# EAGLE design battery_monitor_6803-2 (EAGLE 6.3)
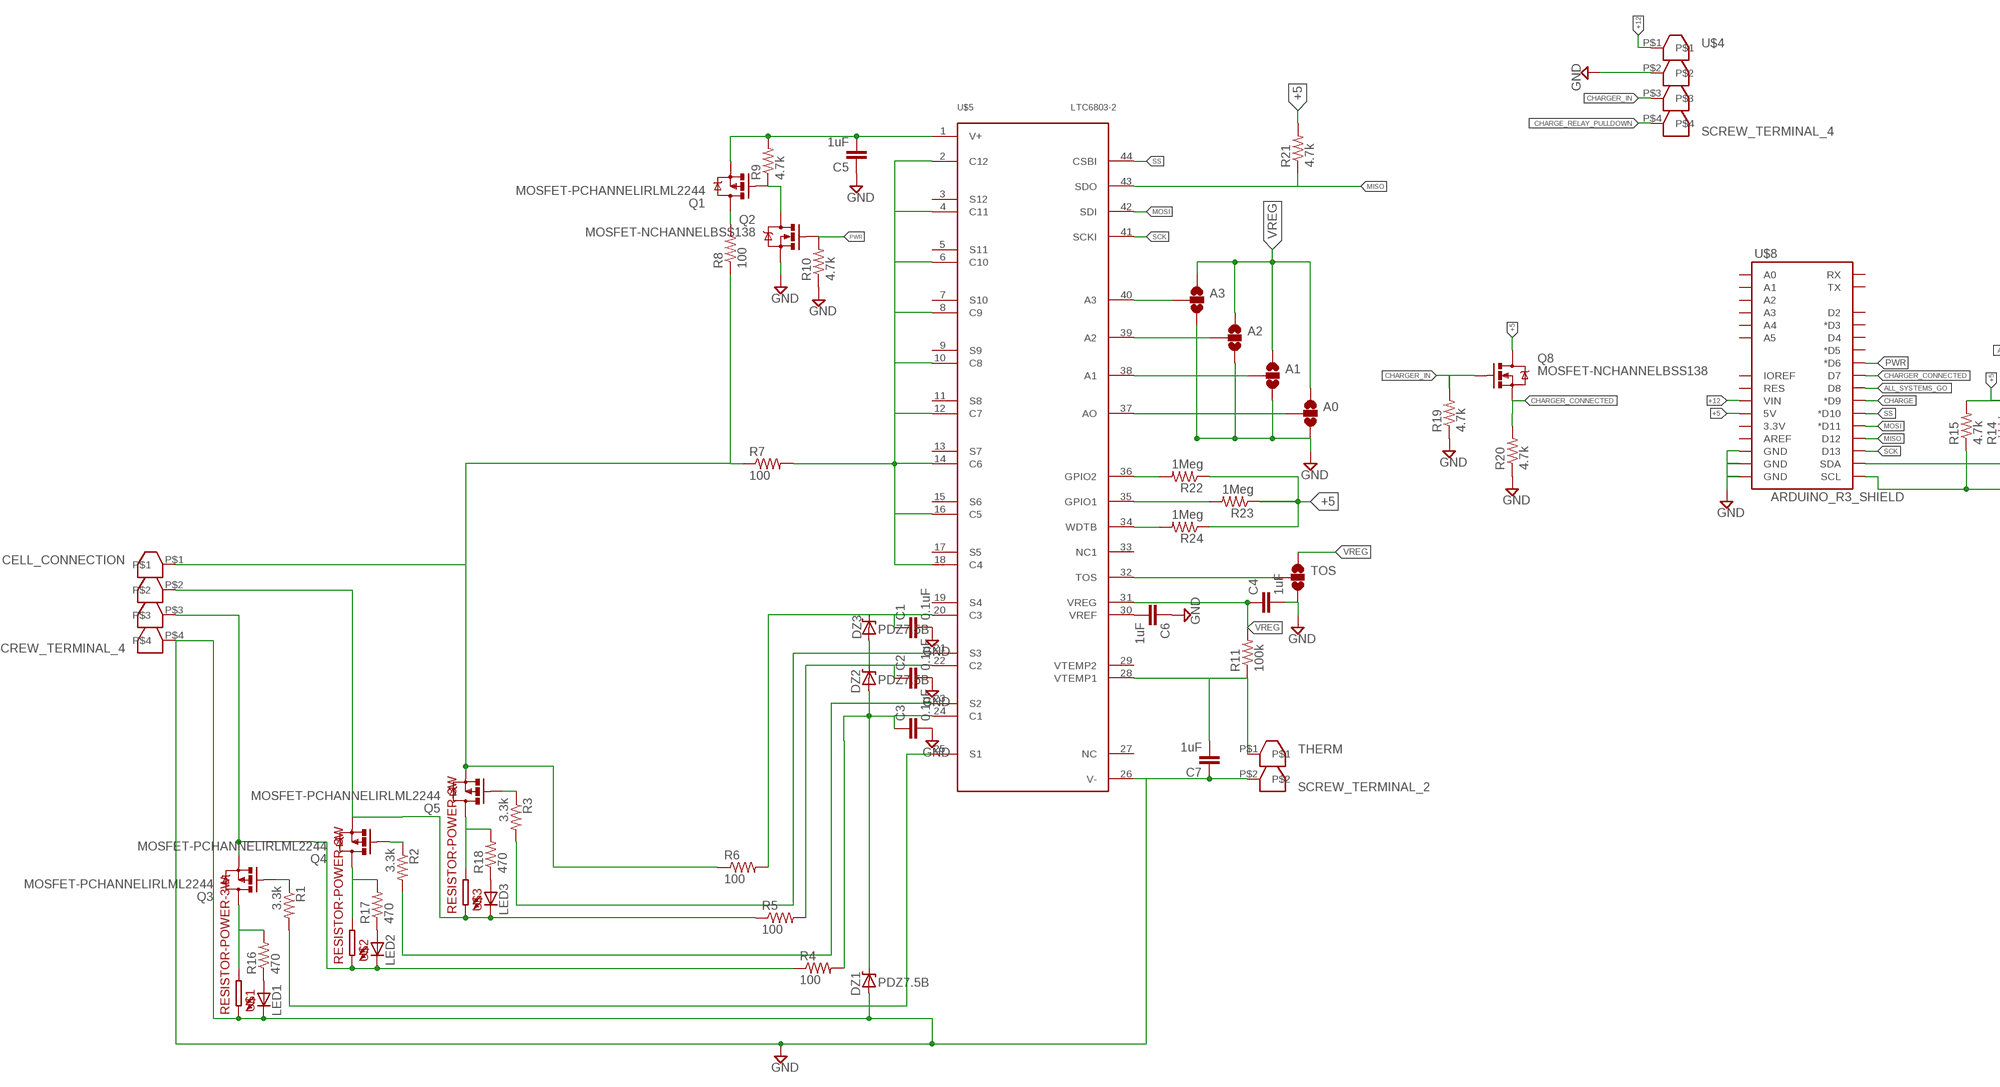
[diagram p0: schematic, sheet 1, part 1 of 2]
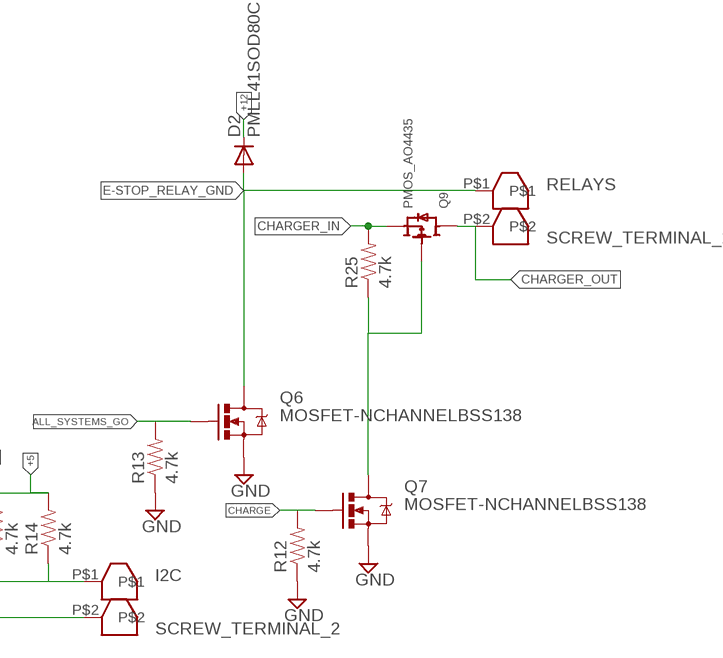
[diagram p1: schematic, sheet 1, part 2 of 2]

## Parts
A0  SOLDERJUMPER_2WAYS  [SJ_3]
A1  SOLDERJUMPER_2WAYS  [SJ_3]
A2  SOLDERJUMPER_2WAYS  [SJ_3]
A3  SOLDERJUMPER_2WAYS  [SJ_3]
C1  0.1uF  0.1UF-100V-10%(0603)  [0603-CAP]
C2  0.1uF  0.1UF-100V-10%(0603)  [0603-CAP]
C3  0.1uF  0.1UF-100V-10%(0603)  [0603-CAP]
C4  1uF  0.1UF-100V-10%(0603)  [0603-CAP]
C5  1uF  0.1UF-100V-10%(0603)  [0603-CAP]
C6  1uF  0.1UF-100V-10%(0603)  [0603-CAP]
C7  1uF  0.1UF-100V-10%(0603)  [0603-CAP]
CELL_CONNECTION  SCREW_TERMINAL_4  [SCREW_TERMINAL_4]
D2  PMLL41SOD80C  [SOD80C]
DZ1  PDZ7.5B  DIODE-ZENER-BZT52  [SOD-323]
DZ2  PDZ7.5B  DIODE-ZENER-BZT52  [SOD-323]
DZ3  PDZ7.5B  DIODE-ZENER-BZT52  [SOD-323]
I2C  SCREW_TERMINAL_2  [SCREW_TERMINAL_2]
LED1  LED0603  [LED-0603]
LED2  LED0603  [LED-0603]
LED3  LED0603  [LED-0603]
Q1  MOSFET-PCHANNELIRLML2244  [SOT23-3]
Q2  MOSFET-NCHANNELBSS138  [SOT23]
Q3  MOSFET-PCHANNELIRLML2244  [SOT23-3]
Q4  MOSFET-PCHANNELIRLML2244  [SOT23-3]
Q5  MOSFET-PCHANNELIRLML2244  [SOT23-3]
Q6  MOSFET-NCHANNELBSS138  [SOT23]
Q7  MOSFET-NCHANNELBSS138  [SOT23]
Q8  MOSFET-NCHANNELBSS138  [SOT23]
Q9  PMOS_AO4435  [SOIC8]
R1  3.3k  3.3KOHM1/10W1%(0603)  [0603-RES]
R2  3.3k  3.3KOHM1/10W1%(0603)  [0603-RES]
R3  3.3k  3.3KOHM1/10W1%(0603)  [0603-RES]
R4  100  3.3KOHM1/10W1%(0603)  [0603-RES]
R5  100  3.3KOHM1/10W1%(0603)  [0603-RES]
R6  100  3.3KOHM1/10W1%(0603)  [0603-RES]
R7  100  3.3KOHM1/10W1%(0603)  [0603-RES]
R8  100  3.3KOHM1/10W1%(0603)  [0603-RES]
R9  4.7k  3.3KOHM1/10W1%(0603)  [0603-RES]
R10  4.7k  3.3KOHM1/10W1%(0603)  [0603-RES]
R11  100k  3.3KOHM1/10W1%(0603)  [0603-RES]
R12  4.7k  3.3KOHM1/10W1%(0603)  [0603-RES]
R13  4.7k  3.3KOHM1/10W1%(0603)  [0603-RES]
R14  4.7k  3.3KOHM1/10W1%(0603)  [0603-RES]
R15  4.7k  3.3KOHM1/10W1%(0603)  [0603-RES]
R16  470  3.3KOHM1/10W1%(0603)  [0603-RES]
R17  470  3.3KOHM1/10W1%(0603)  [0603-RES]
R18  470  3.3KOHM1/10W1%(0603)  [0603-RES]
R19  4.7k  3.3KOHM1/10W1%(0603)  [0603-RES]
R20  4.7k  3.3KOHM1/10W1%(0603)  [0603-RES]
R21  4.7k  3.3KOHM1/10W1%(0603)  [0603-RES]
R22  1Meg  3.3KOHM1/10W1%(0603)  [0603-RES]
R23  1Meg  3.3KOHM1/10W1%(0603)  [0603-RES]
R24  1Meg  3.3KOHM1/10W1%(0603)  [0603-RES]
R25  4.7k  3.3KOHM1/10W1%(0603)  [0603-RES]
RELAYS  SCREW_TERMINAL_2  [SCREW_TERMINAL_2]
THERM  SCREW_TERMINAL_2  [SCREW_TERMINAL_2]
TOS  SOLDERJUMPER_2WAYS  [SJ_3]
U$1  RESISTOR-POWER-3W  [RESISTOR-3W]
U$2  RESISTOR-POWER-3W  [RESISTOR-3W]
U$3  RESISTOR-POWER-3W  [RESISTOR-3W]
U$4  SCREW_TERMINAL_4  [SCREW_TERMINAL_4]
U$5  LTC6803-2  [FSOP-44]
U$8  ARDUINO_R3_SHIELD  [UNO_R3_SHIELD]

## Nets
+5: Q8.3(D) R14.2 R15.2 R21.2 R22.1 R23.1 R24.1 U$8.5V
+12: D2.C U$4.P$1 U$8.VIN
ALL_SYSTEMS_GO: Q6.1(G) R13.2 U$8.D8
CHARGE: Q7.1(G) R12.2 U$8.D9(*D9)
CHARGE_RELAY_PULLDOWN: U$4.P$4
CHARGER_CONNECTED: Q8.2(S) R20.2 U$8.D7
CHARGER_IN: Q8.1(G) Q9.1(SOURCE) Q9.2(SOURCE) Q9.3(SOURCE) R19.2 R25.2 U$4.P$3
CHARGER_OUT: Q9.5(DRAIN) Q9.6(DRAIN) Q9.7(DRAIN) Q9.8(DRAIN) RELAYS.P$2
E-STOP_RELAY_GND: D2.A Q6.3(D) RELAYS.P$1
GND: A0.3 A1.3 A2.3 A3.3 C1.2 C2.2 C3.2 C4.2 C5.1 C6.1 C7.1 CELL_CONNECTION.P$4 DZ1.2(A) LED1.C Q2.2(S) Q6.2(S) Q7.2(S) R10.1 R12.1 R13.1 R19.1 R20.1 THERM.P$2 TOS.3 U$1.P$2 U$4.P$2 U$5.26(V-) U$8.GND@0(GND) U$8.GND@1(GND) U$8.GND@2(GND)
MISO: R21.1 U$5.43(SDO) U$8.D12
MOSI: U$5.42(SDI) U$8.D11(*D11)
N$1: Q7.3(D) Q9.4(GATE) R25.1
N$2: CELL_CONNECTION.P$3 LED2.C Q3.2(S) R4.1 U$2.P$2
N$3: CELL_CONNECTION.P$2 LED3.C Q4.2(S) R5.1 U$3.P$2
N$4: CELL_CONNECTION.P$1 Q5.2(S) R6.1 R7.1 R8.1
N$5: Q3.3(D) R16.2 U$1.P$1
N$6: R2.2 U$5.23(S2)
N$7: Q3.1(G) R1.1
N$8: R1.2 U$5.25(S1)
N$9: R3.2 U$5.21(S3)
N$10: Q4.3(D) R17.2 U$2.P$1
N$11: Q4.1(G) R2.1
N$12: Q5.3(D) R18.2 U$3.P$1
N$13: LED1.A R16.1
N$14: C1.1 DZ3.1(C) R6.2 U$5.20(C3)
N$15: C3.1 DZ1.1(C) DZ2.2(A) R4.2 U$5.24(C1)
N$16: C2.1 DZ2.1(C) DZ3.2(A) R5.2 U$5.22(C2)
N$17: R7.2 U$5.2(C12) U$5.4(C11) U$5.6(C10) U$5.8(C9) U$5.10(C8) U$5.12(C7) U$5.14(C6) U$5.16(C5) U$5.18(C4)
N$18: Q1.3(D) R8.2
N$19: C5.2 Q1.2(S) R9.2 U$5.1(V+)
N$20: Q1.1(G) Q2.3(D) R9.1
N$21: C7.2 R11.1 THERM.P$1 U$5.28(VTEMP1)
N$22: LED2.A R17.1
N$23: LED3.A R18.1
N$24: R22.2 U$5.36(GPIO2)
N$25: R23.2 U$5.35(GPIO1)
N$27: R24.2 U$5.34(WDTB)
N$28: A3.2 U$5.40(A3)
N$29: Q5.1(G) R3.1
N$30: A2.2 U$5.39(A2)
N$31: A1.2 U$5.38(A1)
N$32: A0.2 U$5.37(AO)
N$33: TOS.2 U$5.32(TOS)
N$34: C6.2 U$5.30(VREF)
PWR: Q2.1(G) R10.2 U$8.D6(*D6)
SCK: U$5.41(SCKI) U$8.D13
SCL: I2C.P$2 R15.1 U$8.SCL
SDA: I2C.P$1 R14.1 U$8.SDA
SS: U$5.44(CSBI) U$8.D10(*D10)
VREG: A0.1 A1.1 A2.1 A3.1 C4.1 R11.2 TOS.1 U$5.31(VREG)
Unconnected: U$5.3(S12) U$5.5(S11) U$5.7(S10) U$5.9(S9) U$5.11(S8) U$5.13(S7) U$5.15(S6) U$5.17(S5) U$5.19(S4) U$5.27(NC) U$5.29(VTEMP2) U$5.33(NC1) U$8.3.3V U$8.A0 U$8.A1 U$8.A2 U$8.A3 U$8.A4 U$8.A5 U$8.AREF U$8.D2 U$8.D3(*D3) U$8.D4 U$8.D5(*D5) U$8.IOREF U$8.RES U$8.RX U$8.TX

## Library data of the parts
A0 A1-A3 TOS = SparkFun:SOLDERJUMPER_2WAY: Solder Jumper 2 way solder jumper
C1-C3 = SparkFun-Capacitors:0.1UF-100V-10%(0603): CAP-08390; PROD_ID: CAP-08390
C4-C7 = SparkFun-Capacitors:0.1UF-100V-10%(0603): CAP-08390; PROD_ID: CAP-08390; VALUE: 0.1uF
CELL_CONNECTION U$4 = isaac1:SCREW_TERMINAL_4
D2 = diode:PMLL41*: High-speed diodes Source: http://www.semiconductors.philips.com/acrobat_download/datasheets/PMLL4150_2.pdf
DZ1-DZ3 = SparkFun-DiscreteSemi:DIODE-ZENER: Zener Diode Production Part - 8199 3.4V Zener Voltage
I2C RELAYS THERM = isaac1:SCREW_TERMINAL_2
LED1-LED3 = SparkFun-LED:LED: LEDs Standard schematic elements and footprints for 5mm, 3mm, 1206, and 0603 sized LEDs. 5mm - Spark Fun Electronics SKU : COM-00529 (and others)
Q1 Q3-Q5 = SparkFun-DiscreteSemi:MOSFET-PCHANNEL: Generic PMOSFET; PROD_ID: TRANS-11153
Q2 Q6-Q8 = SparkFun-DiscreteSemi:MOSFET-NCHANNEL: Common NMOSFET Parts MFG P/N Store ID Prod ID FDD8780 TRANS-09984 SI7820DN TRANS-11055 FDS6630A IC-08089 2N7002PW TRANS-11151 FQP30N06L COM-10213 TRANS-10060 BSS123LT1G TRANS-08345 BSS138 TRANS-00830 BS170 2N7000; PROD_ID: TRANS-00830
Q9 = isaac1:PMOS_AO4435
R1-R25 = SparkFun-Resistors:3.3KOHM1/10W1%(0603): RES-07851; PROD_ID: RES-07851
U$1-U$3 = isaac1:RESISTOR-POWER-3W: PR03 series .205" dia x .657" L
U$5 = isaac1:LTC6803-2
U$8 = SparkFun-Boards:ARDUINO_R3_SHIELD: Shield form compatible with the Arduino Uno R3.

## Board
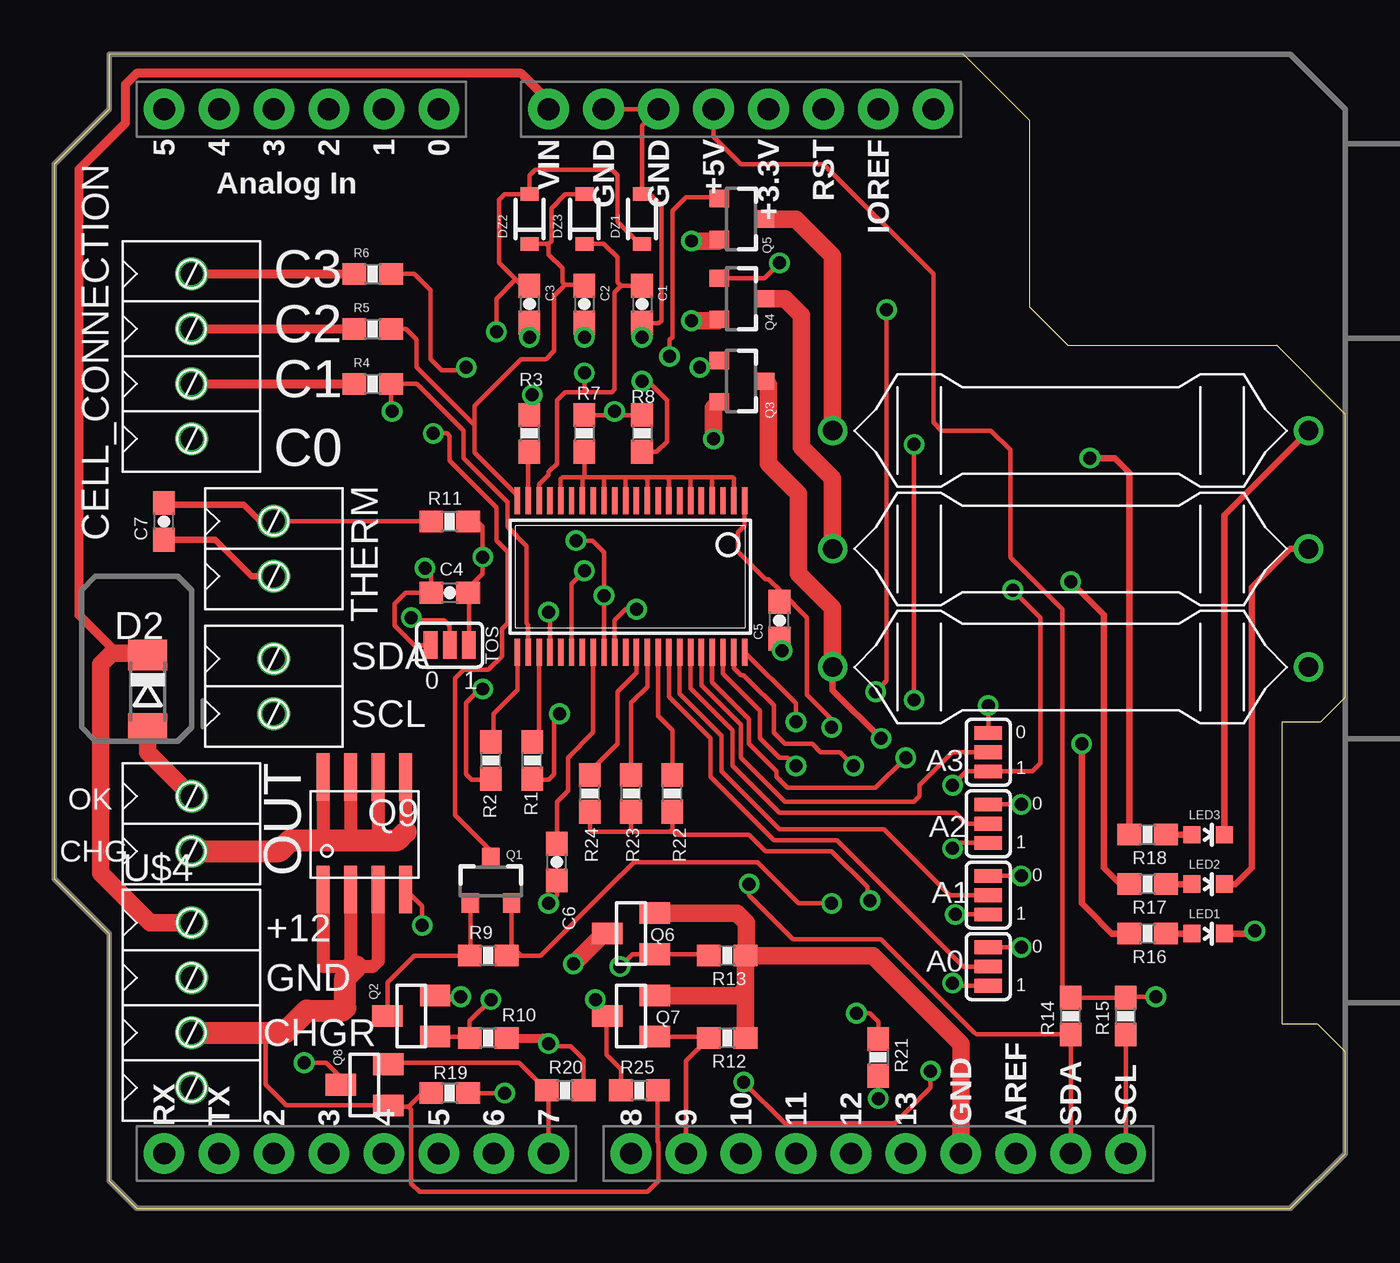
[diagram p2: board, top side]
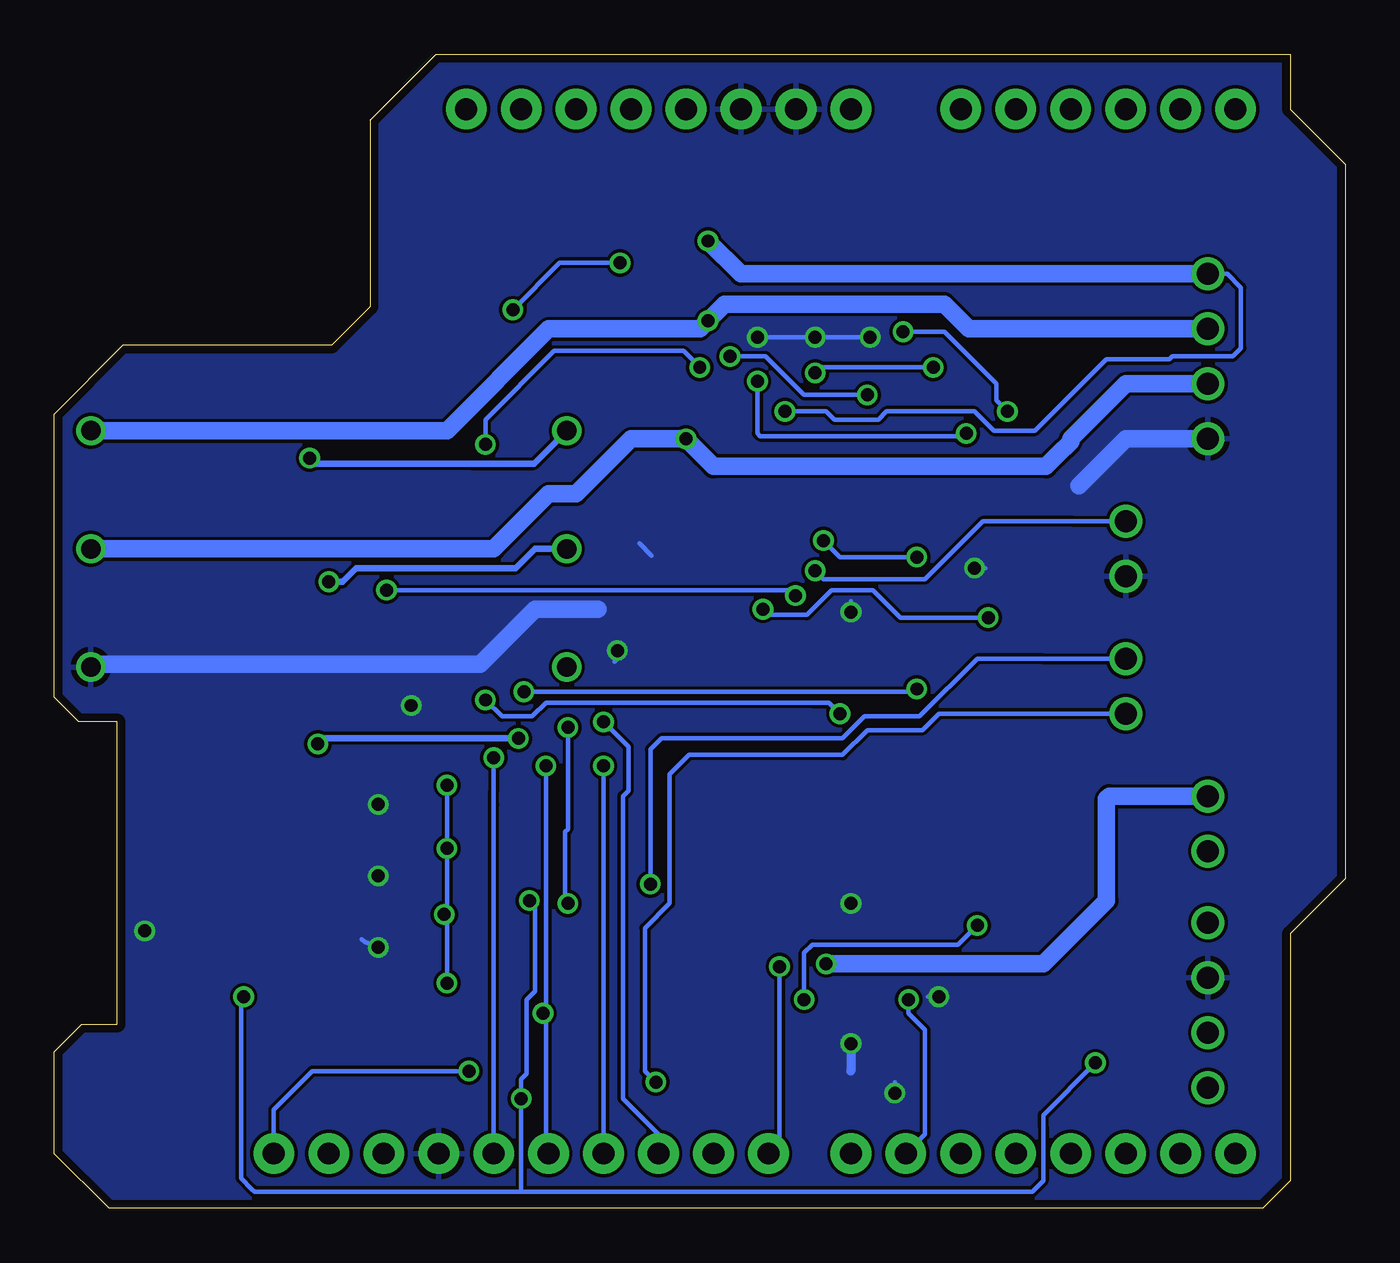
[diagram p3: board, bottom side, seen from below]

Size 59.69 x 53.34 mm. Coordinates in mm from the lower left corner, seen from the top.
Outline: 0,15.24 2.54,12.7 2.54,1.27 3.81,0 57.15,0 59.69,2.54 59.69,7.24 58.42,8.51 56.77,8.51 56.77,22.48 58.55,22.48 59.69,23.62 59.69,36.7 56.52,39.88 46.86,39.88 45.09,41.66 45.09,50.29 42.04,53.34 2.54,53.34 2.54,50.8 0,48.26 0,15.24
Copper layers (1*16): Top 0.0356mm / dielectric 1.5011mm / Bottom 0.0356mm
Design rules "LaenPCBOrder *": minimum track width 6mil, minimum drill 13mil, track to track 6mil, track to pad 6mil, pad to pad 6mil, via to via 6mil, smd to smd 6mil, copper to edge 15mil, drill to drill 6mil, minimum pad ring 7mil, minimum via ring 7mil, stop-mask expansion 4mil, vias tented up to drill 24mil, thermal gap 10mil

### Footprints (pad centres in the part's own frame; a part is rotated, then mirrored left to right if it is on the bottom)
SJ_3 = smd 0.635 x 1.27: 1 -0.889,0; 2 0,0; 3 0.889,0
0603-CAP = smd 1.1 x 1: 1 -0.85,0; 2 0.85,0
SCREW_TERMINAL_4 = drill 1.016 pad 1.422: P$1 0,3.81; P$2 0,1.27; P$3 0,-1.27; P$4 0,-3.81
SOD80C = smd 1.4 x 1.8: A 1.7,0; C -1.7,0
SOD-323 = smd 0.63 x 0.83: 1 -1.15,0; 2 1.15,0
SCREW_TERMINAL_2 = drill 1.016 pad 1.422: P$1 0,1.27; P$2 0,-1.27
LED-0603 = smd 0.8 x 0.8: A 0,-0.75; C 0,0.75
SOT23-3 = smd 0.8 x 0.9: 1 -0.95,-1; 2 0.95,-1; 3 0,1.1
SOT23 = smd 1 x 1.4: 1 -0.95,-1.1; 2 0.95,-1.1; 3 0,1.1
SOIC8 = smd 0.6 x 2.2: 1 -1.905,-2.54; 2 -0.635,-2.54; 3 0.635,-2.54; 4 1.905,-2.54; 5 1.905,2.66; 6 0.635,2.66; 7 -0.635,2.66; 8 -1.905,2.66
0603-RES = smd 1.1 x 1: 1 -0.85,0; 2 0.85,0
RESISTOR-3W = drill 0.9: P$1 0,11; P$2 0,-11
FSOP-44 = smd 0.25 x 1.25: 1 -5.25,-3.5; 2 -4.75,-3.5; 3 -4.25,-3.5; 4 -3.75,-3.5; 5 -3.25,-3.5; 6 -2.75,-3.5; 7 -2.25,-3.5; 8 -1.75,-3.5; 9 -1.25,-3.5; 10 -0.75,-3.5; 11 -0.25,-3.5; 12 0.25,-3.5; 13 0.75,-3.5; 14 1.25,-3.5; 15 1.75,-3.5; 16 2.25,-3.5; 17 2.75,-3.5; 18 3.25,-3.5; 19 3.75,-3.5; 20 4.25,-3.5; 21 4.75,-3.5; 22 5.25,-3.5; 23 5.25,3.5; 24 4.75,3.5; 25 4.25,3.5; 26 3.75,3.5; 27 3.25,3.5; 28 2.75,3.5; 29 2.25,3.5; 30 1.75,3.5; 31 1.25,3.5; 32 0.75,3.5; 33 0.25,3.5; 34 -0.25,3.5; 35 -0.75,3.5; 36 -1.25,3.5; 37 -1.75,3.5; 38 -2.25,3.5; 39 -2.75,3.5; 40 -3.25,3.5; 41 -3.75,3.5; 42 -4.25,3.5; 43 -4.75,3.5; 44 -5.25,3.5
UNO_R3_SHIELD = drill 1.016 pad 1.88: 3.3V 50.8,26.67; 5V 50.8,29.21; A0 50.8,41.91; A1 50.8,44.45; A2 50.8,46.99; A3 50.8,49.53; A4 50.8,52.07; A5 50.8,54.61; AREF 2.54,15.24; D2 2.54,49.53; D3 2.54,46.99; D4 2.54,44.45; D5 2.54,41.91; D6 2.54,39.37; D7 2.54,36.83; D8 2.54,33.02; D9 2.54,30.48; D10 2.54,27.94; D11 2.54,25.4; D12 2.54,22.86; D13 2.54,20.32; GND@0 50.8,31.75; GND@1 50.8,34.29; GND@2 2.54,17.78; IOREF 50.8,21.59; NC 50.8,19.05; RES 50.8,24.13; RX 2.54,54.61; SCL 2.54,10.16; SDA 2.54,12.7; TX 2.54,52.07; VIN 50.8,36.83

### Placement (x,y rotation side)
A0  43.18,11.18 90 top
A1  43.18,14.48 90 top
A2  43.18,17.78 90 top
A3  43.18,21.08 90 top
C1  27.18,41.78 270 top
C2  24.51,41.78 270 top
C3  21.97,41.78 270 top
C4  18.29,28.45 180 top
C5  33.53,27.18 90 top
C6  23.24,16 90 top
C7  5.08,31.75 90 top
CELL_CONNECTION  6.35,39.37 0 top
D2  4.32,23.88 270 top
DZ1  27.18,45.72 90 top
DZ2  21.97,45.72 90 top
DZ3  24.51,45.72 90 top
I2C  10.16,24.13 0 top
LED1  53.34,12.7 270 top
LED2  53.34,14.99 270 top
LED3  53.34,17.27 270 top
Q1  20.19,15.11 0 top
Q2  16.51,8.89 90 top
Q3  31.75,38.23 270 top
Q4  31.75,42.04 270 top
Q5  31.75,45.72 270 top
Q6  26.67,12.7 90 top
Q7  26.67,8.89 90 top
Q8  14.35,5.71 90 top
Q9  14.35,17.27 0 top
R1  22.1,20.7 90 top
R2  20.19,20.7 90 top
R3  21.97,35.81 270 top
R4  14.73,38.1 0 top
R5  14.73,40.64 0 top
R6  14.73,43.18 0 top
R7  24.51,35.81 270 top
R8  27.18,35.81 270 top
R9  20.07,11.68 0 top
R10  20.07,7.87 180 top
R11  18.29,31.75 0 top
R12  31.11,7.87 180 top
R13  31.11,11.68 180 top
R14  46.99,8.89 90 top
R15  49.53,8.89 90 top
R16  50.55,12.7 180 top
R17  50.55,14.99 180 top
R18  50.55,17.27 180 top
R19  18.29,5.33 180 top
R20  23.62,5.46 180 top
R21  38.1,6.99 270 top
R22  28.57,19.18 90 top
R23  26.67,19.18 90 top
R24  24.77,19.18 90 top
R25  27.05,5.46 0 top
RELAYS  6.35,17.78 0 top
THERM  10.16,30.48 0 top
TOS  18.29,26.04 180 top
U$1  46.99,25.02 90 top
U$2  46.99,30.48 90 top
U$3  46.99,35.94 90 top
U$4  6.35,9.4 0 top
U$5  26.67,29.21 180 top
U$8  59.69,0 90 top

### Tracks (layer width: path | path; a pad name or v marks a point on that pad's centre or on a via)
+5  (via drill 0.6)
  Top 0.203: U$8.5V 30.48,49.53 31.75,48.26 35.56,48.26 40.64,43.18 40.64,36.32 41.02,35.94 43.31,35.94 44.2,35.05 44.2,30.1 46.61,27.69 46.61,17.91 46.61,10.12 R14.2 R15.2 49.57,9.78 v50.93,9.78 | Q8.3 13.25,6.05 12.57,6.73 v11.56,6.73 | R21.2 v38.1,5.08 | R24.1 24.77,17.53 24.89,17.4 26.54,17.4 26.67,17.53 | 26.67,17.53 R23.1 | R22.1 28.57,17.53 28.45,17.4 | 28.45,17.4 26.8,17.4 26.67,17.53 | 28.45,17.4 28.7,17.4 28.83,17.27 32.13,17.27 32.89,16.51 35.94,16.51 37.59,14.86 37.59,14.35 v37.72,14.22
  Bottom 0.203: v50.93,9.78 51.05,9.65 51.05,1.4 50.55,0.89 50.42,0.76 38.1,0.76 | 38.1,0.76 14.48,0.76 13.97,1.27 13.97,3.81 13.97,4.32 v11.56,6.73 | 38.1,0.76 v38.1,5.08 38.1,5.97 37.85,6.22 37.85,9.65 37.47,10.03 37.47,13.97 v37.72,14.22
+12
  Top 0.406: U$8.VIN 22.86,51.18 21.59,52.45 3.81,52.45 3.3,51.94 3.3,50.16 3.05,49.91 1.14,48.01 1.14,27.43 2.92,25.65
  Top 0.813: U$4.P$1 4.45,13.21 2.16,15.49 2.16,25.15 2.67,25.65 2.92,25.65 4.24,25.65 D2.C
ALL_SYSTEMS_GO  (via drill 0.6)
  Top 0.203: R13.2 30.2,11.75 Q6.1 26.74,11.75 v26.16,11.18
  Top 0.813: 30.2,11.75 R13.2
  Bottom 0.203: v26.16,11.18 26.16,3.05 U$8.D8
CHARGE
  Top 0.203: Q7.1 30.2,7.94 R12.2 29.21,6.82 U$8.D9
CHARGER_CONNECTED
  Top 0.203: U$8.D7 22.86,5.37 R20.2 21.5,6.73 15.52,6.73 Q8.2
CHARGER_IN
  Top 0.203: R19.2 17.02,5.33 16.38,4.7 | 16.38,4.7 15.52,4.7 Q8.1 10.73,4.76 9.78,5.71 9.78,7.87 9.53,8.13 U$4.P$3 | R25.2 27.9,3.09 27.94,3.05 27.94,1.27 27.43,0.76 16.89,0.76 16.51,1.14 16.51,4.57 16.38,4.7
  Top 0.61: Q9.1 12.45,11.18 13.46,11.18 13.72,11.43 | Q9.2 13.72,11.43 | Q9.3 14.99,11.43 14.73,11.18 13.97,11.18 13.72,11.43
  Top 1.016: U$4.P$3 10.67,8.13 11.68,9.14 13.34,9.14 13.46,9.27 13.46,10.67 13.97,11.18
CHARGER_OUT
  Top 0.61: Q9.8 12.45,17.02 | 12.45,17.02 12.32,16.89 | Q9.7 13.72,17.14 | 13.72,17.14 13.59,17.02 12.45,17.02 | Q9.6 14.99,17.27 | 14.99,17.27 14.73,17.02 13.84,17.02 13.72,17.14 | Q9.5 16.26,17.4 16.26,17.27 15.88,16.89 15.37,16.89 14.99,17.27
  Top 1.016: RELAYS.P$2 10.41,16.51 10.92,17.02 15.88,17.02 16.26,17.4
E-STOP_RELAY_GND  (via drill 0.6)
  Top 0.813: Q6.3 25.4,12.7 v24,11.3 | D2.A 4.32,21.08 RELAYS.P$1
  Bottom 0.813: v24,11.3 13.97,11.3 11.05,14.22 11.05,18.92 10.92,19.05 RELAYS.P$1
GND  (via drill 0.6)
  Top 0.203: C3.2 v21.97,40.26 | v24.51,40.26 C2.2 | v27.18,40.26 C1.2 27.22,40.89 27.94,40.89 28.07,41.02 28.07,46.35 27.94,46.48 27.55,46.87 DZ1.2 27.18,50.04 U$8.GND@0 U$8.GND@1 | Q2.2 17.8,9.65 18.67,9.65 v18.8,9.78 | R19.1 v20.83,5.33 | R20.1 24.47,6.9 23.88,7.49 22.99,7.49 v22.86,7.62 | U$5.26 22.92,27.5 v22.86,27.56 | A0.3 v44.7,12.06 | A1.3 v44.7,15.37 | A2.3 v44.7,18.67 | A3.3 v43.18,23.24 | C5.1 33.53,25.91 v33.66,25.78 | v17.14,29.59 17.44,29.3 C4.2 16.26,28.45 15.75,27.94 15.75,26.92 16.64,26.04 TOS.3 | C6.1 23.24,14.48 v22.86,14.1
  Top 0.305: LED1.C 55.37,12.7 v55.5,12.83 | C7.1 7.45,30.9 9.14,29.21 THERM.P$2
  Top 0.406: R10.1 22.61,7.87 v22.86,7.62
  Top 0.813: R13.1 37.85,11.68 41.91,7.62 U$8.GND@2 | R12.1 31.96,10.16 | 31.96,10.16 R13.1 | Q7.2 31.64,9.84 31.96,10.16 | Q6.2 31.56,13.65 32,13.21 32,11.72 R13.1
  Bottom 0.203: v21.97,40.26 v24.51,40.26 v27.18,40.26 | 32.64,30.73 32.07,30.16 | v20.83,5.33 20.83,5.84 | v22.86,27.56 22.86,28.07 | v44.7,12.06 45.34,12.32 45.47,12.45 | v44.7,15.37 45.09,15.37 | v44.7,18.67 44.83,18.67 44.7,18.8 | v43.18,23.24 43.18,23.62 | v33.66,25.78 33.66,25.4 33.78,25.27 | v17.14,29.59 16.64,29.59 | v22.86,14.1 22.86,13.72 | v18.8,9.78 19.3,9.78
  Bottom 0.406: v22.86,7.62 22.86,6.35
  Bottom 0.813: CELL_CONNECTION.P$4 10.16,35.56 11.68,34.04 12.32,33.4 | 34.54,27.69 37.47,27.69 40.01,25.15 57.86,25.15 U$1.P$2
  pour Bottom: -1.27,-1.27 59.69,-1.27 59.69,54.61 -1.27,54.61
MISO  (via drill 0.6)
  Top 0.203: v36.96,20.45 36.32,21.08 35.43,21.08 35.05,21.46 33.78,21.46 33.27,21.97 33.27,23.24 32.26,24.26 31.88,24.64 31.75,24.64 31.42,24.97 U$5.43 | v37.08,9.02 37.72,9.02 38.1,8.64 R21.1
  Bottom 0.203: v36.96,20.45 36.96,9.14 | 36.96,9.14 36.96,2.67 U$8.D12 | v37.08,9.02 36.96,9.14
MOSI  (via drill 0.6)
  Top 0.203: v34.29,20.45 33.91,20.83 33.53,20.83 32.64,21.72 32.64,22.99 32,23.62 31.5,24.13 30.92,24.71 U$5.42
  Bottom 0.203: v34.29,20.45 U$8.D11
N$1  (via drill 0.6)
  Top 0.203: R25.1 26.2,6.44 25.53,7.11 25.53,8.85 | 25.53,8.85 Q7.3 | 25.53,8.85 25.53,9.14 v25.02,9.65 | v17.02,13.08 17.02,13.97 Q9.4
  Bottom 0.203: v25.02,9.65 25.02,11.81 24.64,12.19 17.91,12.19 v17.02,13.08
N$2  (via drill 0.6)
  Top 0.305: LED2.C 54.61,14.99 55.37,15.75 55.37,28.7 57.15,30.48 U$2.P$2
  Top 0.406: CELL_CONNECTION.P$3 R4.1
  Top 0.813: v30.48,35.56 30.48,37.01 Q3.2
  Bottom 0.813: CELL_CONNECTION.P$3 10.16,38.1 12.7,35.56 12.7,35.43 13.34,34.8 13.84,34.29 29.21,34.29 29.72,34.8 v30.48,35.56 33.02,35.56 35.56,33.02 36.83,33.02 39.37,30.48 U$2.P$2
N$3  (via drill 0.6)
  Top 0.305: LED3.C 54.09,32.04 U$3.P$2
  Top 0.406: CELL_CONNECTION.P$2 R5.1
  Top 0.813: v29.46,41.02 30.68,41.02 Q4.2
  Bottom 0.813: CELL_CONNECTION.P$2 17.4,40.64 17.91,41.15 18.54,41.78 28.7,41.78 v29.46,41.02 | 29.34,41.15 v29.46,41.02 | U$3.P$2 41.53,35.94 36.83,40.64 29.84,40.64 v29.46,41.02
N$4  (via drill 0.6)
  Top 0.203: R7.1 R8.1 26.07,36.66 v25.91,36.83
  Top 0.406: CELL_CONNECTION.P$1 R6.1
  Top 0.813: v29.46,44.7 30.68,44.7 Q5.2
  Bottom 0.203: v25.91,36.83 24,36.83 23.62,36.45 21.59,36.45 21.21,36.83 17.14,36.83 16.76,36.45 16.26,35.94 14.35,35.94 11.05,39.24 8.13,39.24 8,39.37 5.21,39.37 4.83,39.75 4.83,42.55 5.46,43.18 CELL_CONNECTION.P$1
  Bottom 0.813: CELL_CONNECTION.P$1 27.94,43.18 v29.46,44.7
N$5  (via drill 0.6)
  Top 0.305: R16.2 48.9,12.7 47.75,13.84 47.5,14.1 47.5,19.43 | 47.5,19.43 v47.5,21.46 47.5,19.43 | U$1.P$1 35.99,23.95 v38.23,21.72
  Top 0.813: U$1.P$1 35.99,27.76 34.42,29.34 34.42,33.02 33.02,34.42 33.02,38.06 Q3.3
  Bottom 0.305: v38.23,21.72 47.24,21.72 v47.5,21.46
N$6
  Top 0.203: R2.2 20.32,21.68 20.32,22.86 21.42,23.96 U$5.23
N$7  (via drill 0.6)
  Top 0.203: v39.75,23.5 v39.75,35.31 | v29.84,38.86 30.43,38.86 Q3.1 | R1.1 22.39,19.81 22.86,19.81 23.11,20.07 23.11,22.61 v23.37,22.86
  Bottom 0.203: v39.75,23.5 38.99,22.73 37.59,22.73 36.96,23.37 24.64,23.37 23.88,23.37 v23.37,22.86 | v39.75,35.31 39.75,36.45 36.58,39.62 30.61,39.62 v29.84,38.86
N$8
  Top 0.203: R1.2 22.42,21.62 U$5.25
N$9
  Top 0.203: 21.92,34.91 R3.2 21.92,34.91 | U$5.21 21.92,34.91
N$10  (via drill 0.6)
  Top 0.305: R17.2 49.28,14.99 48.51,15.75 48.51,27.43 v46.99,28.96
  Top 0.813: U$2.P$1 35.99,33.73 34.92,34.8 34.54,35.18 34.54,41.27 33.78,42.04 Q4.3
  Bottom 0.305: v46.99,28.96 46.35,28.96 45.72,29.59 38.35,29.59 37.47,30.48 U$2.P$1
N$11  (via drill 0.6)
  Top 0.203: Q4.1 32.83,42.99 v33.53,43.69 | v38.48,41.53 38.48,24.38 v37.97,23.88 | v19.81,24 19.68,24 19.3,23.62 19.05,23.37 19.05,20.07 19.3,19.81 20.15,19.81 R2.1
  Bottom 0.203: v33.53,43.69 36.32,43.69 v38.48,41.53 | v37.97,23.88 19.94,23.88 v19.81,24
N$12  (via drill 0.6)
  Top 0.305: R18.2 49.7,33.11 49.7,34 49.02,34.67 v47.88,34.67
  Top 0.813: U$3.P$1 35.99,44.02 34.29,45.72 Q5.3
  Bottom 0.305: U$3.P$1 37.51,34.42 40.39,34.42 47.62,34.42 v47.88,34.67
N$13
  Top 0.305: LED1.A R16.1
N$14  (via drill 0.6)
  Top 0.203: C1.1 26.2,42.63 | 26.2,42.63 26.04,42.8 26.04,43.94 25.4,44.58 DZ3.1 | 26.2,42.63 25.91,42.34 25.91,39.62 25.91,37.85 25.78,37.72 24.64,37.72 | 24.64,37.72 23.62,37.72 23.24,37.34 23.24,35.18 23.24,34.42 22.86,34.04 22.86,33.91 22.42,33.47 U$5.20 | R6.2 16.64,43.18 17.4,42.42 17.4,39.24 17.91,38.73 18.92,38.73 v19.05,38.86 | v24.51,38.61 24.51,37.85 24.64,37.72
  Bottom 0.203: v19.05,38.86 24.26,38.86 v24.51,38.61
N$15  (via drill 0.6)
  Top 0.203: DZ1.1 27.06,44.57 26.04,45.59 26.04,47.75 25.78,48.01 22.23,48.01 21.97,47.75 DZ2.2 20.83,46.86 20.57,46.61 20.57,43.69 21.14,43.12 21.34,42.93 | C3.1 21.63,42.63 21.34,42.93 | v15.62,36.83 15.58,36.87 R4.2 16.76,38.1 18.92,35.94 18.92,34.67 20.95,32.64 20.95,31.5 21.84,30.61 21.84,27.05 21.92,26.98 U$5.24 | v20.45,40.51 20.45,42.04 21.34,42.93
  Bottom 0.203: v20.45,40.51 18.54,40.51 16.13,38.1 16.13,37.34 v15.62,36.83
N$16
  Top 0.203: 21.42,32.94 19.43,34.92 19.43,36.2 | R5.2 16.26,40.64 16.76,40.13 16.76,38.86 19.43,36.2 | DZ2.1 22.74,44.57 | 22.74,44.57 22.86,44.45 22.86,44.07 23.5,43.43 23.5,42.8 23.62,42.67 | 23.62,42.67 24.47,42.67 C2.1 | 22.74,44.57 22.85,44.57 22.99,44.7 22.99,46.23 23.62,46.86 DZ3.2 | 23.62,42.67 23.11,42.16 23.11,39.75 23.11,39.62 22.73,39.24 21.59,39.24 19.56,37.21 19.43,37.08 19.43,36.2
  Top 0.254: 21.42,32.94 U$5.22
N$17
  Top 0.203: 24.38,33.78 23.5,33.78 23.42,33.71 23.42,33.58 U$5.18 | 24.38,33.78 24.51,33.78 | 24.51,33.78 25.4,33.78 | 25.4,33.78 26.42,33.78 | 26.42,33.78 27.3,33.78 | 27.3,33.78 27.43,33.78 | 27.43,33.78 28.32,33.78 | 28.32,33.78 29.34,33.78 | 29.34,33.78 30.35,33.78 | 30.35,33.78 31.37,33.78 31.42,33.73 U$5.2 | 30.35,33.78 30.42,33.72 U$5.4 | 29.34,33.78 29.42,33.7 U$5.6 | 28.32,33.78 28.42,33.68 U$5.8 | 27.42,33.77 27.43,33.78 | 26.42,33.78 | 25.42,33.76 25.4,33.78 | 24.38,33.78 24.42,33.75 U$5.16 | R7.2 24.51,33.78 | U$5.14 25.42,33.76 | 25.42,33.76 25.4,33.78 | U$5.12 26.42,33.78 | 26.42,33.78 | U$5.10 27.42,33.67 27.3,33.78
N$18  (via drill 0.6)
  Top 0.203: R8.2 27.85,34.96 28.32,35.43 28.32,37.34 27.56,38.1 27.3,38.1 v27.18,38.23 | v17.53,35.81 18.16,35.81 18.29,35.69 18.29,34.54 20.45,32.38 20.45,30.86 20.95,30.35 20.95,27.05 20.7,26.8 20.7,25.53 20.07,24.89 19.18,24.89 18.92,24.89 18.54,24.51 18.54,18.16 20.19,16.51 Q1.3
  Bottom 0.203: v27.18,38.23 27.18,35.81 27.05,35.69 18.16,35.69 17.65,35.69 v17.53,35.81
N$19  (via drill 0.6)
  Top 0.203: 33.59,28.51 33.02,29.08 32.89,29.08 31.62,30.35 31.62,31.24 31.92,31.54 U$5.1 | 33.59,28.51 34.8,27.3 34.8,23.75 35.94,22.61 v35.94,22.23 | v35.94,14.1 34.42,14.1 32.77,15.75 32.51,16 26.8,16 25.65,14.86 22.48,11.68 22.23,11.68 21.59,11.68 | 21.59,11.68 R9.2 | C5.2 33.53,28.45 33.59,28.51 | Q1.2 21.14,12.13 21.59,11.68
  Bottom 0.203: v35.94,22.23 35.94,17.53 36.07,17.4 36.07,14.22 v35.94,14.1
N$20
  Top 0.203: Q2.3 15.41,10.46 16.64,11.68 R9.1 19.24,11.71 Q1.1
N$21  (via drill 0.6)
  Top 0.203: THERM.P$1 R11.1 | U$5.28 23.92,27.86 23.92,28.87 v24.51,29.46
  Top 0.305: THERM.P$1 9.53,31.75 8.76,32.51 5.17,32.51 C7.2
  Bottom 0.203: THERM.P$1 12.57,31.75 16.76,31.75 19.43,29.08 24.13,29.08 v24.51,29.46
N$22
  Top 0.305: LED2.A R17.1
N$23
  Top 0.305: LED3.A R18.1
N$24
  Top 0.203: U$5.36 27.92,24.15 27.92,22.75 27.94,22.73 28.57,22.1 R22.2
N$25
  Top 0.203: U$5.35 27.42,24.12 26.67,23.37 R23.2
N$27
  Top 0.203: U$5.34 26.92,24.76 26.04,23.88 26.04,23.37 26.04,21.46 24.77,20.19 R24.2
N$28
  Top 0.203: U$5.40 29.92,24.18 31.75,22.35 31.75,20.83 33.78,18.8 38.35,18.8 39.75,18.8 40.01,19.05 40.01,19.56 41.53,21.08 42.04,21.08 A3.2
N$29  (via drill 0.6)
  Top 0.203: R3.1 21.97,37.47 v22.1,37.59 | v28.45,39.37 28.45,40.13 28.57,40.26 28.57,46.1 29.21,46.74 30.68,46.74 Q5.1
  Bottom 0.203: v28.45,39.37 26.8,39.37 25.02,37.59 v22.1,37.59
N$30
  Top 0.203: U$5.39 29.42,24.05 31.37,22.1 31.37,20.57 31.37,20.45 33.53,18.29 34.42,18.29 38.1,18.29 41.66,18.29 42.16,17.78 A2.2
N$31
  Top 0.203: U$5.38 28.92,23.79 30.86,21.84 30.86,20.19 33.53,17.53 38.35,17.53 41.4,14.48 A1.2
N$32
  Top 0.203: U$5.37 28.42,23.65 30.35,21.72 30.35,19.94 30.48,19.81 33.27,17.02 33.91,17.02 36.2,17.02 42.04,11.18 A0.2
N$33  (via drill 0.6)
  Top 0.203: TOS.2 18.29,26.92 18.03,27.18 16.64,27.18 v16.51,27.3 | v26.92,27.69 26.42,27.69 25.91,27.18 25.91,25.72 U$5.32
  Bottom 0.203: v16.51,27.3 20.57,27.3 21.84,28.57 23.75,28.57 24.89,27.43 26.67,27.43 v26.92,27.69
N$34
  Top 0.203: U$5.30 24.92,22 23.75,20.83 23.75,19.3 23.24,18.8 C6.2
PWR  (via drill 0.6)
  Top 0.203: Q2.1 19.15,7.94 R10.2 19.22,8.68 v20.19,9.65
  Bottom 0.203: v20.19,9.65 20.19,9.02 19.43,8.26 19.43,3.43 U$8.D6
SCK  (via drill 0.6)
  Top 0.203: U$5.41 30.42,24.32 31.62,23.11 32.13,22.61 32.13,21.46 33.4,20.19 33.4,19.94 33.91,19.43 37.97,19.43 v39.37,20.83
  Bottom 0.203: U$8.D13 39.37,18.67 39.37,19.3 v39.37,20.83
SCL  (via drill 0.6)
  Top 0.203: U$8.SCL R15.1 | v40.51,6.35 40.51,5.59 38.86,3.94 33.78,3.94 v31.88,5.84
  Bottom 0.203: I2C.P$2 15.62,22.86 18.8,22.86 19.56,22.1 22.1,22.1 23.24,20.95 30.35,20.95 31.24,20.07 31.24,14.1 32.38,12.95 32.38,6.35 v31.88,5.84 | v40.51,6.35 47.75,6.35 49.53,4.57 U$8.SCL
SDA  (via drill 0.6)
  Top 0.203: U$8.SDA R14.1 42.63,8.04 42.55,8.13 38.23,12.45 34.16,12.45 32.13,14.48 v32.13,14.99
  Bottom 0.203: I2C.P$1 13.97,25.4 17.02,25.4 19.68,22.73 22.23,22.73 23.24,21.72 31.62,21.72 32.13,21.21 v32.13,14.99
SS  (via drill 0.6)
  Top 0.203: v34.29,22.48 34.29,23.34 U$5.44
  Bottom 0.203: U$8.D10 31.75,3.43 33.4,5.08 33.4,19.05 33.15,19.3 33.15,21.34 v34.29,22.48
VREG  (via drill 0.6)
  Top 0.203: R11.2 19.56,31.75 19.81,31.5 v19.81,30.1 19.81,29.34 19.14,28.66 C4.1 19.18,28.41 TOS.1 | U$5.31 v25.42,28.32 | v25.42,28.32 25.42,28.55 25.42,28.83 | 25.42,28.83 25.42,30.33 24.89,30.86 v24.13,30.86 | A0.1 41.66,10.29 v41.53,10.41 | v41.66,13.59 A1.1 | A2.1 41.78,16.89 v41.53,16.64 | v41.53,19.56 42.16,20.19 A3.1 45.21,20.19 45.59,20.57 45.59,27.3 v44.32,28.57 | v25.42,28.32 25.42,28.83
  Bottom 0.203: v19.81,30.1 23.37,30.1 v24.13,30.86 | v41.53,10.41 41.53,13.46 v41.66,13.59 41.53,13.72 v41.53,16.64 v41.53,19.56 | v44.32,28.57 25.67,28.57 v25.42,28.32

### Text on the board
tPlace: C3 | C2 | C1 | C0 | SDA | 0 | 1 | SCL | 0 | 1 | OK | 0 | 1 | CHG | OUT | 0 | 1 | +12 | 0 | GND | 1 | CHGR